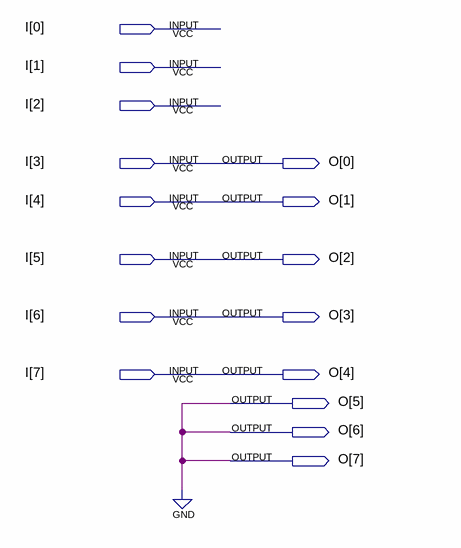
[diagram p0: schematic sheet]
// Quartus schematic SHIFT_RIGHT_3.bdf as structural Verilog: 0 symbols, 16 pins
module SHIFT_RIGHT_3 (
  input  [7:0] I,
  output [7:0] O
);


  assign O = {3'b000, I[7:3]};
endmodule
